# EasyEDA Pro project SmartHome-Voice-Assit.epro, board PCB
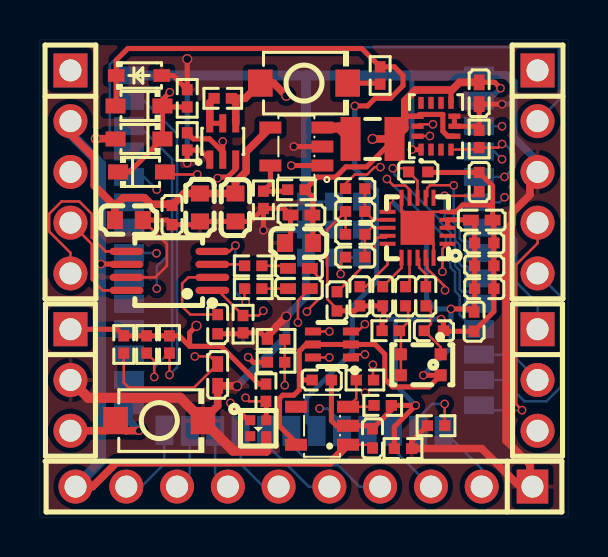
[diagram p3: board, top side]
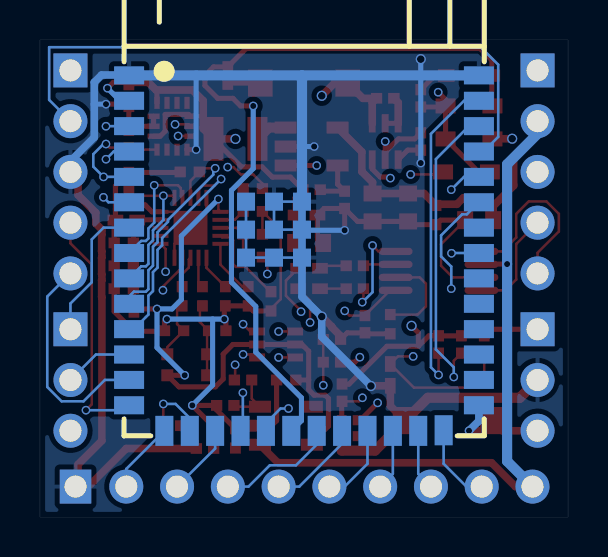
[diagram p4: board, bottom side, seen from below]

Outline 26.42 x 23.88 mm; copper layers: Top Layer, Inner1, Inner2, Bottom Layer. Coordinates in mm from the lower left corner of the outline.
Outline path: rectangle 0,23.88 26.42,0
Stack: Top Layer 0.035mm 外层铜厚1oz / Dielectric1 0.2104mm 7628 RC49% 8.6mil / Inner1 0.0152mm 内层铜厚 / Dielectric2 1.065mm 1.1mm H/HOZ Copper / Inner2 0.0152mm 内层铜厚 / Dielectric3 0.2104mm 7628 RC49% 8.6mil / Bottom Layer 0.035mm 外层铜厚1oz

## Design rules (mm)
template: 自定义配置
spacing copperThickness1oz (default): track to track 0.102, other pairs 0.152 to 0.3
spacing copperThickness2oz: track to track 0.203, other pairs 0.152 to 0.3
track width copperThickness1oz (default): min 0.127, default 0.254, max 2.54
track width copperThickness2oz: min 0.203, default 0.254, max 2.54
differential pair differentialPair (default): width min 0.127, default 0.254, max 2.54; gap min 0.152, default 0.152
via viaSize (default): diameter min 0.432, default 0.432, max 10; hole min 0.305, default 0.305, max 6.299

## Placement (name value [footprint] x y rotation side)
C4  100nF  [C0402]  8.89 7.11 90 top
C9  10uF  [C0603]  9.78 15.49 90 top
C10  10uF  [C0603]  12.95 13.72 0 top
C11  100nF  [C0402]  13.08 15.11 0 top
C14  1uF  [C0402#2]  19.3 11.05 90 top
C15  1uF  [C0402#2]  18.29 11.05 90 top
C16  100nF  [C0402#2]  22.22 13.72 0 top
C17  10uF  [C0402]  22.1 14.86 180 top
C18  22pF  [C0402#2]  19.71 9.32 180 top
C19  1uF  [C0402#2]  17.15 11.05 90 top
C20  100nF  [C0402]  21.97 21.21 90 top
C21  1uF  [C0402#2]  16 11.05 90 top
C22  1uF  [C0402#2]  14.86 10.8 90 top
C24  1uF  [C0402#2]  15.77 13.01 0 top
C25  1uF  [C0402#2]  15.77 16.44 0 top
C26  1uF  [C0402#2]  14.1 6.86 180 top
C27  100nF  [C0402#2]  21.72 9.78 90 top
C28  1uF  [C0402#2]  22.22 12.57 180 top
C29  22pF  [C0402#2]  15.77 15.29 0 top
C30  22pF  [C0402#2]  15.77 14.15 0 top
C32  22pF  [C0402#2]  21.97 16.76 270 top
C33  22pF  [C0402#2]  18.92 17.27 180 top
C36  100nF  [C0402]  12.95 12.45 180 top
C37  100nF  [C0402]  12.95 11.43 180 top
C38  1uF  [C0402#2]  6.6 15.11 90 top
C39  22uF  [C0603]  4.44 14.86 0 top
C40  22uF  [C0603]  8 15.49 270 top
C41  1uF  [C0402#2]  8.89 9.65 90 top
C43  1uF  [C0402#2]  22.22 11.43 180 top
C44  1uF  [C0402#2]  16.64 3.94 270 top
D2  1N5819WS  [SOD-323_L1.8-W1.3-LS2.5-RD]  4.95 20.57 180 top
D3  1N5819WS  [SOD-323_L1.8-W1.3-LS2.5-RD]  4.95 18.92 180 top
D4  1N5819WS  [SOD-323_L1.8-W1.3-LS2.5-RD]  5.08 17.27 0 top
D5  BZT52C3V3S  [SOD-323_L1.7-W1.3-LS2.6-RD]  4.95 22.1 0 top
H1  PZ254V-11-05P  [HDR-TH_5P-P2.54-V-M]  1.52 17.27 270 top
H2  PZ254V-11-05P  [HDR-TH_5P-P2.54-V-M]  24.89 17.27 270 top
H5  (NC)  [HDR-TH_3P-P2.54-V-M]  1.52 6.86 270 top
H6  (NC)  [HDR-TH_3P-P2.54-V-M]  24.89 6.86 270 top
H7  (NC)  [HDR-TH_10P-P2.54-V-M]  13.21 1.52 180 top
L1  2.2uH  [IND-SMD_L2.5-W2.0_MHCHL2520]  16.64 18.92 180 top
MIC1  ZTS6216  [MIC-SMD_4P-L2.8-W1.9-P1.84-TL]  19.05 7.62 270 top
Q5  LBSS138DW1T1G  [SC-88-6_L2.0-W1.3-P0.65-LS2.1-BL]  14.6 8.64 90 top
Q6  CJ3439KDW  [SOT-363_L2.1-W1.3-P0.65-LS2.3-BL]  9.14 18.8 0 top
R1  10kΩ  [R0402]  4.19 8.64 90 top
R10  100kΩ  [R0402]  12.83 16.38 180 top
R12  22.1kΩ  [R0402]  11.18 15.88 270 top
R15  0Ω  [R0402]  17.55 9.32 0 top
R18  10kΩ  [R0402]  10.16 9.65 270 top
R19  100kΩ  [R0402]  10.67 12.57 0 top
R20  100kΩ  [R0402]  10.67 11.43 0 top
R23  100kΩ  [R0402]  11.81 7.75 0 top
R24  200kΩ  [R0402]  11.81 8.89 180 top
R26  0Ω  [R0402]  18.16 3.43 0 top
R27  5.1kΩ  [R0402]  5.33 8.64 90 top
R28  5.1kΩ  [R0402]  6.48 8.64 270 top
R29  100kΩ  [R0402]  21.97 18.92 270 top
R31  1MΩ  [R0402]  7.37 20.95 90 top
R35  1MΩ  [R0402]  9.14 20.95 180 top
R36  10kΩ  [R0402]  16.26 6.86 0 top
R38  1MΩ  [R0402]  7.37 18.8 270 top
R41  10kΩ  [R0402]  19.81 4.57 0 top
R42  5.1kΩ  [R0402]  17.02 22.1 90 top
R43  1MΩ  [R0402]  17.15 5.59 0 top
R44  10kΩ  [R0402]  11.3 6.22 270 top
SW2  TS-1088-AR02016  [SW-SMD_L3.9-W3.0-P4.45]  5.97 4.83 0 top
SW3  TS-1088-AR02016  [SW-SMD_L3.9-W3.0-P4.45]  13.21 21.72 0 top
U2  TLV62569DBVR  [SOT-23-5_L3.0-W1.7-P0.95-LS2.8-BR]  12.83 18.54 0 top
U4  BMI270  [LGA-14_L3.0-W2.5-P0.50-BR]  19.81 19.56 270 top
U5  ES8311  [WQFN-20_L3.0-W3.0-P0.40-BL-EP1.7]  18.89 14.48 90 top
U6  NS4150B  [MSOP-8_L3.0-W3.0-P0.65-LS5.0-BL]  6.48 12.32 90 top
U13  ESP32-S3-WROOM-1-N16R8  [WIRELM-SMD_ESP32-S3-WROOM-1]  13.21 13.21 180 bottom
U14  LP5907MFX-3.3/NOPB  [SOT-23-5_L3.0-W1.7-P0.95-LS2.8-BR]  14.11 4.57 0 top
U15  WS2812E-1313  [LED-SMD_4P-L1.3-W1.3-P0.80_WS2812E-1313]  10.92 4.44 0 top

## Footprints (pads in the part's own frame, mm; a bottom-side part is the same pattern mirrored in y, then rotated)
C0402
  rect 0.79x0.54 smd: 1(-0.545,0) 2(0.545,0)
C0402#2
  rect 0.566x0.54 smd: 1(-0.481,0) 2(0.481,0)
C0603
  rect 0.8x0.9 smd: 1(-0.7,0) 2(0.7,0)
HDR-TH_3P-P2.54-V-M
  rect 1.7x1.7 hole 1.1: 1(-2.54,0)
  round 1.7 hole 1.1: 2(0,0) 3(2.54,0)
HDR-TH_5P-P2.54-V-M
  rect 1.7x1.7 hole 1.1: 1(-5.08,0)
  round 1.7 hole 1.1: 2(-2.54,0) 3(0,0) 4(2.54,0) 5(5.08,0)
HDR-TH_10P-P2.54-V-M
  rect 1.575x1.7 hole 1.1: 1(-11.43,0)
  round 1.7 hole 1.1: 2(-8.89,0) 3(-6.35,0) 4(-3.81,0) 5(-1.27,0) 6(1.27,0) 7(3.81,0) 8(6.35,0) 9(8.89,0) 10(11.43,0)
IND-SMD_L2.5-W2.0_MHCHL2520
  rect 1x2.2 smd: 1(-1.1,0) 2(1.1,0)
LED-SMD_4P-L1.3-W1.3-P0.80_WS2812E-1313
  rect 0.5x0.5 smd: 1(-0.4,0.4) 2(-0.4,-0.4) 3(0.4,-0.4) 4(0.4,0.4)
LGA-14_L3.0-W2.5-P0.50-BR
  rect 0.6x0.27 smd: 1(1.17,-0.75) 2(1.17,-0.25) 3(1.17,0.25) 4(1.17,0.75) 8(-1.17,0.75) 9(-1.17,0.25) 10(-1.17,-0.25) 11(-1.17,-0.75)
  rect 0.27x0.6 smd: 5(0.5,0.92) 6(0,0.92) 7(-0.5,0.92) 12(-0.5,-0.92) 13(0,-0.92) 14(0.5,-0.92)
MIC-SMD_4P-L2.8-W1.9-P1.84-TL
  rect 0.6x0.6 smd: 1(-0.525,0.995) 2(-0.525,-0.995) 3(0.525,-0.995) 4(0.525,0.995)
MSOP-8_L3.0-W3.0-P0.65-LS5.0-BL
  oval 0.364x1.692 smd: 1(-0.975,-2.146) 2(-0.325,-2.146) 3(0.325,-2.146) 4(0.975,-2.146) 5(0.975,2.146) 6(0.325,2.146) 7(-0.325,2.146) 8(-0.975,2.146)
R0402
  rect 0.566x0.54 smd: 1(-0.433,0) 2(0.433,0)
SC-88-6_L2.0-W1.3-P0.65-LS2.1-BL
  rect 0.4x0.8 smd: 1(-0.65,-0.95) 2(0,-0.95) 3(0.65,-0.95) 4(0.65,0.95) 5(0,0.95) 6(-0.65,0.95)
SOD-323_L1.7-W1.3-LS2.6-RD
  rect 0.83x0.63 smd: 1(-1.14,0) 2(1.14,0)
SOD-323_L1.8-W1.3-LS2.5-RD
  rect 1x0.75 smd: 1(-1.173,0) 2(1.173,0)
SOT-23-5_L3.0-W1.7-P0.95-LS2.8-BR
  rect 1.1x0.6 smd: 1(1.3,-0.95) 2(1.3,0) 3(1.3,0.95) 4(-1.3,0.95) 5(-1.3,-0.95)
SOT-363_L2.1-W1.3-P0.65-LS2.3-BL
  rect 0.35x0.916 smd: 1(-0.65,-0.908) 2(0,-0.908) 3(0.65,-0.908) 4(0.65,0.908) 5(0,0.908) 6(-0.65,0.908)
SW-SMD_L3.9-W3.0-P4.45
  rect 1.23x1.36 smd: 1(-2.185,0) 2(2.185,0)
WIRELM-SMD_ESP32-S3-WROOM-1
  rect 1.5x0.9 smd: 1(-8.75,8.895) 2(-8.75,7.625) 3(-8.75,6.355) 4(-8.75,5.085) 5(-8.75,3.815) 6(-8.75,2.545) 7(-8.75,1.275) 8(-8.75,0.005) 9(-8.75,-1.265) 10(-8.75,-2.535) 11(-8.75,-3.805) 12(-8.75,-5.075) 13(-8.75,-6.345) 14(-8.75,-7.615) 27(8.75,-7.615) 28(8.75,-6.345) 29(8.75,-5.075) 30(8.75,-3.805) 31(8.75,-2.535) 32(8.75,-1.265) 33(8.75,0.005) 34(8.75,1.275) 35(8.75,2.545) 36(8.75,3.815) 37(8.75,5.085) 38(8.75,6.355) 39(8.75,7.625) 40(8.75,8.895)
  rect 0.9x1.5 smd: 15(-6.985,-8.895) 16(-5.715,-8.895) 17(-4.445,-8.895) 18(-3.175,-8.895) 19(-1.905,-8.895) 20(-0.635,-8.895) 21(0.635,-8.895) 22(1.905,-8.895) 23(3.175,-8.895) 24(4.445,-8.895) 25(5.715,-8.895) 26(6.985,-8.865)
  rect 0.9x0.9 smd: 41(-2.9,-0.225) 41(-2.9,1.175) 41(-2.9,2.575) 41(-1.5,-0.225) 41(-1.5,1.175) 41(-1.5,2.575) 41(-0.1,-0.225) 41(-0.1,1.175) 41(-0.1,2.575)
WQFN-20_L3.0-W3.0-P0.40-BL-EP1.7
  rect 0.2x0.8 smd: 1(-0.8,-1.5) 2(-0.4,-1.5) 3(0,-1.5) 4(0.4,-1.5) 5(0.8,-1.5) 11(0.8,1.5) 12(0.4,1.5) 13(0,1.5) 14(-0.4,1.5) 15(-0.8,1.5)
  rect 0.8x0.2 smd: 6(1.5,-0.8) 7(1.5,-0.4) 8(1.5,0) 9(1.5,0.4) 10(1.5,0.799) 16(-1.5,0.8) 17(-1.5,0.4) 18(-1.5,0) 19(-1.5,-0.4) 20(-1.5,-0.8)
  rect 1.7x1.7 smd: 21(0,0)

## Nets
As in the schematic.

Pads without a net: U4 2 3 9 10 11; U5 2; U13 31 32 34; U14 4; U15 2

## Via types
v1: diameter 0.432, hole 0.305, Top Layer to Bottom Layer, 59 vias
v2: diameter 0.508, hole 0.381, Top Layer to Bottom Layer, 7 vias

## Routing (per net, layer and track width the routed paths; a pad name or vN(x,y) marks a point on that pad's centre or on a via; arc(x,y) is an arc through that point)
3V3: length 52
  Top Layer w0.127: 18.38,19.56 18.31,19.5
  Top Layer w0.254: R44.1 10.95,6.66 9.06,8.55 7.49,8.55 ; 7.49,8.55 6.96,9.07 R28.1 R27.2 R1.2 3.86,9.4 H5.1 ; 7.49,8.55 7.49,9.23 v2(7.83,9.57) ; 13.65,15.08 C10.2 ; 13.65,15.08 C11.2 ; 13.65,15.08 13.65,15.99 R10.1 13.89,17.01 14.79,17.01 15.31,17.53 16.34,17.53 L1.1 ; 18.31,19.5 18.25,19.44 ; v1(23.04,21.46) 22.75,21.75 C20.2 ; U4.8 20.56,21.32 ; 18.25,20.03 18.28,20.06 U4.12 18.98,20.15 20.15,20.15 20.15,19.31 20.4,19.06 U4.5
  Top Layer w0.381: C20.2 20.99,21.75 20.61,21.37 18.78,21.37 18.25,20.83 18.25,19.44 L1.1 v2(16.64,18.92)
  Inner1 w0.381: v2(16.64,18.92) 17.15,18.92 18.41,17.65 18.41,15.62 17.4,14.61 12.86,14.61 v2(7.83,9.57)
  Bottom Layer w0.254: v1(23.04,21.46) 22.41,20.83 U13.2
AGND: length 49
  Top Layer w0.127: U5.10 18.09,15.28 U5.21 ; C22.1 14.86,10.42 14.37,10.9 14.37,14.38 C29.1 C30.1 ; U5.21 19.69,15.28 U5.5 ; U5.21 19.69,13.68 U5.20
  Top Layer w0.254: 22.64,15.41 22.64,14.86 22.71,14.8 C16.2 C28.1 C43.1 22.71,10.29 C27.1 20.22,9.3 C18.1 20.19,9.78 v1(20.07,9.91) ; 22.64,15.41 22.64,16.57 C32.1 19.43,17.25 C33.1 ; 22.64,15.41 22.43,15.62 21.16,15.62 20.81,15.28 U5.5 ; C26.1 14.58,4.82 14.83,4.57 U14.2 16.49,4.57 C44.1 17.58,5.36 R43.2 v1(18.8,5.59) 17.73,4.52 R26.1 ; R15.1 17.12,9.83 v1(17.2,9.91) 17.2,10.52 C19.1 C21.1 15.75,10.31 C22.1
  Bottom Layer w0.254: 17.78,9.91 v1(20.07,9.91) ; 17.78,9.91 v1(17.2,9.91) ; 17.78,9.91 17.78,6.6 v1(18.8,5.59)
GND: length 134.5
  Top Layer w0.127: C39.2 6.35,13.65 6.35,12.57 5.77,11.99 U6.7
  Top Layer w0.254: U4.1 v1(18.6,18.39) ; Q6.1 8.02,18.36 7.37,18.36 v1(7.37,17.72) ; R12.2 v1(11.18,14.35) ; R12.2 10.53,14.79 C9.1 C40.2 7.84,14.63 C38.1 6.38,14.86 C39.2 ; R12.2 12.21,15.44 C11.1 12.54,14 C10.1 ; v1(23.11,20.66) C20.1 R29.1 21.77,19.56 U4.6 U4.7 ; R24.2 11.05,9.22 R18.2 10.11,9.17 C41.1 ; R26.2 18.59,3.79 R41.1 ; D5.2 6.66,22.1 R31.2 v2(7.37,22.92) ; U2.2 v1(12.7,18.54)
  Top Layer w0.381: 24.51,1.65 H7.1 ; 24.51,1.65 24.51,2.63 23.32,3.82 23.32,11 23.33,11.02 23.33,11.84 23.32,11.86 23.32,12.15 23.33,12.16 23.33,12.98 23.32,13 23.32,13.29 23.33,13.3 23.33,14.13 23.32,14.14 23.32,14.39 23.62,14.69 23.62,15.23 24.51,16.12 24.51,16.89 H2.3 ; 24.51,1.65 23.88,1.65 22.1,3.43 R26.2 ; R24.2 11.38,9.06 11.82,9.5 11.82,9.53 v2(12.32,10.03) ; SW2.2 8.89,5.56 C4.1 9.85,6.57 v2(9.86,6.56)
  Top Layer w0.508: H5.2 2.41,5.97 7.01,5.97 SW2.2 9.65,3.33 11.32,3.33 U15.3
  Bottom Layer w0.127: U13.41 U13.41 U13.41 U13.41 ; U13.41 U13.41 U13.41 U13.41 U13.41
  Bottom Layer w0.254: v1(23.11,20.66) 23.7,20.66 ; U13.41 13.28,14.35 v1(11.18,14.35) ; v1(18.6,18.39) 18.6,22.1 ; v2(7.37,22.92) v1(7.37,17.72) ; v1(12.7,18.54) 13.31,18.54
  Bottom Layer w0.381: H2.3 24.89,17.81 23.7,19 23.7,21.76 23.33,22.12 21.98,22.12 ; v2(9.86,6.56) 12.32,9.02 v2(12.32,10.03) 13.31,11.02 U13.41 U13.41 U13.41
  Bottom Layer w0.508: U13.1 13.31,22.1 ; 13.31,22.1 U13.41 ; 13.31,22.1 U13.40
VBAT: length 16.3
  Top Layer w0.381: Q6.4 9.79,20.74 R35.1 10.26,20.95 SW3.1 11.68,21.72 v2(12.32,21.08)
  Inner2 w0.381: H1.1 3.2,20.68 11.91,20.68 v2(12.32,21.08)
VBUS: length 3.2
  Top Layer w0.381: D3.2 3.77,18.93 v2(2.79,18.93)
  Inner2 w0.381: v2(2.79,18.93) 2.79,18.54 H1.3
VCC_LED: length 21.2
  Top Layer w0.254: 8.89,17.02 9.4,17.02 9.79,17.41 Q6.3 ; R23.1 10.67,7.75 v1(10.41,8) ; U15.1 10.4,4.84 v1(9.53,5.72)
  Inner1 w0.254: 9.33,6.91 9.33,5.91 v1(9.53,5.72) ; 9.33,6.91 9.2,6.91 9.14,6.86 7.52,6.86 5.31,9.07 5.31,13.38 v1(8.89,16.96) 8.89,17.02 ; 9.33,6.91 v1(10.41,8)
VIN: length 53.1
  Top Layer w0.127: U14.1 16.47,3.62 C44.2
  Top Layer w0.254: U6.6 4.31,12.66 v1(3.05,12.66) 3.06,12.64
  Top Layer w0.381: U2.4 10.31,18.28 10.31,17.29 9.78,16.76 C9.2 C40.1 7.2,16.19 C38.2 6.6,15.65 5.56,15.65 5.23,15.98 4.16,15.98 3.75,15.56 ; 3.75,15.56 2.72,16.59 2.72,17.98 1.52,19.18 H1.2 ; 3.75,15.56 C39.1 ; U14.1 14.51,2.72 3.82,2.72 2.63,1.52 H7.10
  Bottom Layer w0.508: H1.2 1.52,19.18 3.05,17.65 v1(3.05,12.66) 3.05,2.79 H7.10
BOOT: length 5.3
  Top Layer w0.381: H5.3 3.28,4.32 SW2.1 4.29,4.32 v1(4.95,4.32)
  Bottom Layer w0.381: v1(4.95,4.32) 4.46,4.81 U13.27
CODEC_3V3: length 49.3
  Top Layer w0.127: v1(17.49,15.91) 17.49,15.38 U5.11
  Top Layer w0.254: 12.98,6.86 12.98,8.3 13.31,8.64 Q5.5 16.76,8.64 17.25,8.15 17.25,6.91 17.64,6.52 19.47,6.52 20.04,7.09 v1(19.18,7.09) ; 12.98,6.86 12.98,6.37 12.7,6.1 12.15,6.1 11.98,5.94 11.98,4.55 12.81,3.72 U14.5 ; 12.98,6.86 C26.2 ; U5.3 U5.4 21.54,14.88 C17.2 21.74,14.67 C16.1 C28.2 C43.2 21.74,10.29 C27.2 21.56,10.41 v1(20.56,10.41) ; 9.14,18.27 8.48,18.92 7.67,18.92 R38.1 ; 9.14,18.27 Q6.2 ; 9.14,18.27 v1(9.14,18.8)
  Inner1 w0.254: v1(17.49,15.91) 17.45,15.88 17.44,15.88 16.38,16.93 16.38,17.61 14.44,19.56 9.91,19.56 v1(9.14,18.8)
  Bottom Layer w0.254: v1(17.49,15.91) 19.34,14.06 19.34,10.88 19.81,10.41 v1(20.56,10.41) 20.56,8.48 v1(19.18,7.09)
CONN1: length 26
  Inner1 w0.127: H2.1 9.02,22.35 8.36,21.69 6.26,21.69 5.84,21.27 v1(5.84,16.38)
  Bottom Layer w0.127: v1(5.84,16.38) 5.2,17.02 U13.36
CONN2: length 31.9
  Bottom Layer w0.127: U13.37 4.22,18.29 3.49,19.02 3.49,22.64 4.36,23.51 25.96,23.51 25.96,20.88 H2.2
ES_I2C_SCL: length 9.4
  Top Layer w0.127: v1(20.13,12.28) 20.13,13.42 U5.1 ; Q5.4 v1(14.48,9.29)
  Inner1 w0.127: v1(20.13,12.28) 19.96,12.45 17.64,12.45 v1(14.48,9.29)
ES_I2C_SDA: length 8.1
  Top Layer w0.127: v1(16.26,8.14) 15.71,8.14 15.56,7.99 ; v1(20.26,11.35) 20.26,11.53 19.37,12.43 19.37,12.89 U5.19
  Inner1 w0.127: v1(16.26,8.14) 17.06,8.14 v1(20.26,11.35)
ESP32_DN: length 11
  Bottom Layer w0.127: U13.13 23.17,6.86 24.24,5.79 25.33,5.79 26.05,6.51 26.05,11.03 H2.5
ESP32_DP: length 12.2
  Top Layer w0.127: H2.4 24.89,13.7 23.83,12.63 23.83,5.64 v1(24.12,5.35)
  Bottom Layer w0.127: v1(24.12,5.35) 22.2,5.35 U13.14
ESP_EN: length 32.6
  Top Layer w0.127: v1(7.75,8.04) 8.51,8.04 C4.2 7.71,6.48 4.44,6.48 4.19,6.73 4.19,8.2
  Inner1 w0.127: v1(23.11,19.56) 22.48,20.19 19.3,20.19 19.08,19.96 19.08,18.22 18.84,17.98 18.84,15.15 17.78,14.1 15.72,14.1 11.4,9.78 9.49,9.78 v1(7.75,8.04)
  Bottom Layer w0.127: v1(23.11,19.56) 23.11,19.56 U13.3
EXT2_CONN1: length 3.6
  Bottom Layer w0.127: U13.15 22.1,2.41 H7.2
EXT2_CONN2: length 3.6
  Bottom Layer w0.127: H7.3 17.65,3.43 U13.17
EXT2_CONN3: length 6
  Bottom Layer w0.127: U13.21 12.57,3.63 13.61,2.59 14.92,2.59 15.98,1.52 H7.4
EXT2_CONN4: length 4.7
  Bottom Layer w0.127: H7.5 13.44,1.52 11.3,3.67 U13.22
EXT2_CONN5: length 4
  Bottom Layer w0.127: H7.6 11.18,1.52 10.03,2.67 U13.23
EXT2_CONN6: length 3.1
  Bottom Layer w0.127: H7.7 8.76,2.16 U13.24
EXT2_CONN7: length 3.1
  Bottom Layer w0.127: H7.8 7.49,2.16 U13.25
EXT2_CONN8: length 4.1
  Bottom Layer w0.127: H7.9 5.08,1.52 6.22,2.67 U13.26
EXT_CONN2: length 7
  Bottom Layer w0.127: U13.7 23.24,14.48 23.83,13.89 23.83,11.75 24.89,10.69 H6.1
EXT_CONN3: length 3.5
  Bottom Layer w0.127: U13.12 23.62,8.13 H6.2
EXT_CONN4: length 30.2
  Inner1 w0.127: H6.3 15.87,4.32 14.26,5.92 12.26,5.92 10.92,7.25 10.92,8.25 10.67,8.51 9.65,8.51 8.64,7.49 7.49,7.49 6.86,8.13 6.86,10.41 v1(5.84,11.43)
  Bottom Layer w0.127: U13.35 5.06,15.15 5.3,15.15 6.35,14.1 6.35,13.05 5.84,12.54 v1(5.84,11.43)
I2C_SCL: length 44.4
  Top Layer w0.127: v1(19.66,19.65) 18.99,19.65 U4.13 ; 15.56,9.29 15.89,9.29 v1(16.26,9.65) ; 6.48,8.2 v1(6.48,7.11)
  Inner1 w0.127: v1(16.26,9.65) 16.26,10.03 17.94,11.71 20.02,11.71 20.15,11.85 20.51,11.85 20.51,11.84 20.6,11.84 20.96,12.19 20.96,12.57 20.58,12.95 20.29,12.95 19.81,13.43 19.81,15.19 19.69,15.31 19.69,15.65 19.81,15.77 19.81,16.26 20.06,16.51 20.1,16.51 20.27,16.68 20.27,16.78 20.3,16.81 20.3,18.94 19.66,19.59 v1(19.66,19.65)
  Inner2 w0.127: v1(6.48,7.11) 6.48,8.13 7,8.65 14.45,8.65 14.99,9.18 14.99,9.52 15.11,9.65 v1(16.26,9.65)
  Bottom Layer w0.127: U13.39 5.2,20.83 6.86,19.18 6.86,7.49 v1(6.48,7.11)
I2C_SDA: length 40.1
  Top Layer w0.127: Q5.6 v1(14.48,7.99) ; 5.33,8.2 5.72,7.82 v1(5.72,7.01) ; v1(19.51,19.07) 18.9,19.07 U4.14
  Inner2 w0.127: v1(5.72,7.01) 6.04,6.68 9.32,6.68 9.67,7.03 13.52,7.03 v1(14.48,7.99) 15.48,7.99 16.76,9.27 16.76,14.32 18.84,16.39 18.84,17.98 19.51,18.65 v1(19.51,19.07)
  Bottom Layer w0.127: U13.38 4.59,19.56 4.71,19.44 5.08,19.44 6.61,17.91 6.61,8.39 5.72,7.49 v1(5.72,7.01)
I2S_BCK: length 7.4
  Top Layer w0.127: U5.6 19.79,16.08 v1(20.24,16.08) 21.77,16.08 C32.2
  Bottom Layer w0.127: v1(20.24,16.08) 20.24,14.87 20.76,14.35 20.76,13.85 20.99,13.62 20.99,12.67 21.12,12.55 21.35,12.55 U13.9
I2S_DI: length 6
  Top Layer w0.127: U5.7 19.37,16.06 19.37,16.47 19.51,16.6 v1(20.7,16.6)
  Bottom Layer w0.127: U13.8 21.35,13.82 21.12,13.82 20.99,13.94 20.99,14.44 20.7,14.73 v1(20.7,16.6)
I2S_DO: length 11.3
  Top Layer w0.127: v1(17.36,16.92) 17.68,16.59 18.28,16.59 18.49,16.38 U5.9
  Bottom Layer w0.127: 21.12,10.01 21.72,9.4 U13.11 ; v1(17.36,16.92) 20.31,13.97 20.31,13.6 20.53,13.37 20.53,12.48 20.76,12.26 20.76,11.31 20.99,11.08 20.99,10.13 21.12,10.01
I2S_WS: length 11.3
  Top Layer w0.127: U5.8 18.89,16.83 C33.2 18.26,17.45 v1(17.65,17.45)
  Bottom Layer w0.127: v1(17.65,17.45) 17.75,17.36 17.75,17.14 20.01,14.87 20.01,14.77 20.53,14.25 20.53,13.75 20.76,13.52 20.76,12.58 20.99,12.35 20.99,11.4 21.12,11.28 21.72,11.28 22.05,10.95 22.05,10.77 U13.10
IMU_INT: length 6.1
  Top Layer w0.127: v1(23.11,18.67) 22.94,18.49 R29.2 21.87,18.39 U4.4
  Bottom Layer w0.127: v1(23.11,18.67) 23.24,18.67 23.75,18.16 23.75,17.54 v1(23.24,17.02) U13.5
KEY: length 39.2
  Top Layer w0.254: v1(15.75,20.57) 16.38,20.57 16.76,20.95 17.53,20.95 18.16,21.59 18.16,22.1 17.73,22.53 R42.2 16.1,23.45 4.4,23.45 3.81,22.86 3.81,20.61 D2.2
  Bottom Layer w0.254: U13.20 13.34,4.82 13.34,5.97 15.62,8.25 15.62,10.54 16.84,11.76 16.84,16.35 15.75,17.44 v1(15.75,20.57)
LED_CTL: length 7.8
  Top Layer w0.127: v1(10.29,5.97) 10.47,5.79 R44.2
  Top Layer w0.254: R44.2 11.32,5.77 U15.4
  Inner1 w0.127: v1(13.98,5.43) 10.82,5.43 v1(10.29,5.97)
  Bottom Layer w0.127: v1(13.98,5.43) 14.38,5.43 15.11,4.7 U13.19
MCU_VCC_CTL: length 20.6
  Top Layer w0.127: D4.2 6.38,17.14 v1(7.87,17.14)
  Inner2 w0.127: v1(7.87,17.14) 8.44,17.14 11.38,20.09 19.85,20.09 20.09,19.85 20.09,19.41 21.59,17.91 v1(23.11,17.91)
  Bottom Layer w0.127: v1(23.11,17.91) 22.73,18.29 U13.4
OUTN: length 6.8
  Top Layer w0.127: v1(15.04,12.16) 15.04,12.76 C24.1 ; v1(12.9,9.74) 12.9,10.84 C37.1
  Inner1 w0.127: v1(12.9,9.74) 13.93,9.74 15.04,10.85 v1(15.04,12.16)
OUTP: length 13.8
  Top Layer w0.127: C25.1 15.29,16.69 15.75,17.14 16.37,17.14 16.74,17.51 v1(17.03,17.51) ; C36.1 14.11,11.84 14.11,11.07 13.36,10.32 v1(13.36,10.28)
  Inner2 w0.127: v1(17.03,17.51) 13.36,13.84 v1(13.36,10.28)
PA_CTL: length 13.6
  Top Layer w0.127: v1(11.17,10.32) 10.94,10.08 10.16,10.08 8.9,11.34 U6.1
  Inner1 w0.127: v1(11.17,10.32) 9.33,10.32 8.03,9.02 7.62,9.02 7.24,9.4 7.24,11.68 5.83,13.09 v1(5.83,13.2)
  Bottom Layer w0.127: v1(5.83,13.2) 5.82,13.21 U13.33
POWER_EN: length 16.6
  Top Layer w0.254: v1(6.5,21.26) 6.13,20.89 D2.1 ; U2.1 v1(12.57,17.59) ; D2.1 D3.1 4.47,17.27 D4.1 ; D2.1 6.18,20.52 R31.1
  Inner1 w0.254: v1(12.57,17.59) 9.21,17.59 8.13,18.67 8.13,20.07 6.93,21.26 v1(6.5,21.26)
PREP_VCC_CTL: length 13.6
  Top Layer w0.127: v1(16.65,7.62) 16.65,6.89 R36.2
  Inner1 w0.127: v1(23.24,16) 23.24,13.72 17.15,7.62 v1(16.65,7.62)
  Bottom Layer w0.127: U13.6 22.99,15.75 v1(23.24,16)
S3_IO10: length 8.4
  Top Layer w0.127: v1(12.24,6.59) R23.2 R24.1
  Inner1 w0.127: v1(12.24,6.59) 12.62,6.22 v1(16.27,6.22)
  Bottom Layer w0.127: U13.18 16.27,4.43 v1(16.27,6.22)
S3_IO46: length 3.3
  Top Layer w0.127: R41.2 v1(20.25,5.66)
  Bottom Layer w0.127: v1(20.25,5.66) 19.63,5.66 18.92,4.95 U13.16
VON: length 9.3
  Top Layer w0.127: H1.5 1.52,13.22 0.46,14.29 0.46,15.17 1.08,15.8 1.97,15.8 2.59,15.17 2.59,13.99 3.29,13.29 U6.5
VOP: length 5.3
  Top Layer w0.127: H1.4 2.59,13.67 2.59,11.89 3.13,11.34 U6.8
$2N2825: length 1.6
  Top Layer w0.508: L1.2 14.97,19.49 U2.3
$2N2826: length 2.7
  Top Layer w0.254: R10.2 12.32,16.31 R12.1 11.53,16.66 U2.5
$2N27093: length 2
  Top Layer w0.254: Q6.6 Q6.5
  Top Layer w0.381: Q6.6 8.49,20.74 R35.2
$2N28112: length 1.6
  Top Layer w0.254: SW3.2 16.97,21.72 R42.1
$3N889: length 1.6
  Top Layer w0.127: U6.3 10.16,12.64 R19.1
$3N890: length 5
  Top Layer w0.127: U6.4 9.48,13.29 v1(9.78,13.59) ; 10.28,10.75 10.23,10.8 R20.1
  Bottom Layer w0.127: v1(9.78,13.59) 9.78,11.25 10.28,10.75
  vias: v1(10.29,10.75)
$3N893: length 4.7
  Top Layer w0.127: U6.2 7.42,11.99 7.11,11.68 7.11,10.54 7.52,10.13 C41.2
$3N898: length 1.4
  Top Layer w0.127: 12.41,12.45 12.28,12.57 R19.2
$3N899: length 1.3
  Top Layer w0.127: R20.2 12.41,11.43
$3N1850: length 2.5
  Top Layer w0.127: C25.2 C29.2 16.67,14.88 U5.12
$3N1851: length 2.4
  Top Layer w0.127: U5.13 16.58,14.48 C30.2 C24.2
$3N1859: length 2.9
  Top Layer w0.127: U5.15 17.39,12.63 16.29,11.53 C21.2
$3N1860: length 4.4
  Top Layer w0.127: C22.2 14.89,11.28 16.13,12.52 16.62,12.52 16.75,12.65 16.75,13.84 16.9,13.99 17.3,13.99 U5.14
$3N1862: length 1.8
  Top Layer w0.127: U5.16 18.09,12.47 C19.2
$3N2186: length 1.6
  Top Layer w0.127: C14.2 19.3,12.15 18.97,12.49 18.97,12.89 U5.18
$3N2191: length 1.5
  Top Layer w0.127: C15.2 18.49,11.73 U5.17
$3N2596: length 2.9
  Top Layer w0.127: 20.04,8.14 20.04,8.5 C18.2 19.56,9.66 19.56,10.57
$3N2598: length 3.7
  Top Layer w0.127: MIC1.3 18.06,9.25 R15.2 18.41,9.76 18.41,10.57
$3N16147: length 2.8
  Top Layer w0.127: R43.1 16.64,5.52 U14.3 15.82,5.93 R36.1

## Copper pours and planes (outline as drawn; the poured copper is in the pictures)
3V3 on Inner2: -9.02,35.81 33.53,35.81 33.53,-6.6 -9.02,-6.6
GND on Top Layer: -14.73,41.91 27.81,41.91 27.81,-1.52 -14.73,-1.52
GND on Bottom Layer: -11.56,38.86 31.12,38.86 31.12,-4.19 -11.56,-4.19
GND on Inner1: -6.35,32.51 36.96,32.51 36.96,-9.02 -6.35,-9.02
